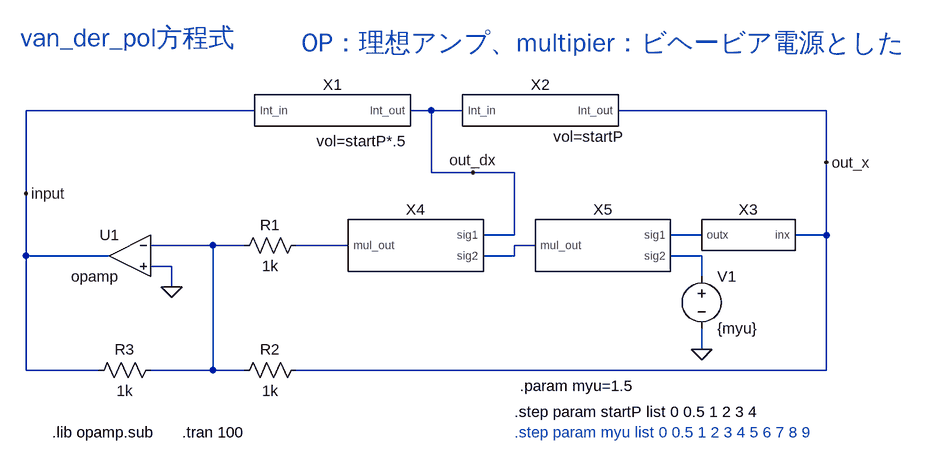
[diagram p0: schematic van_der_pol-lv1.asc]
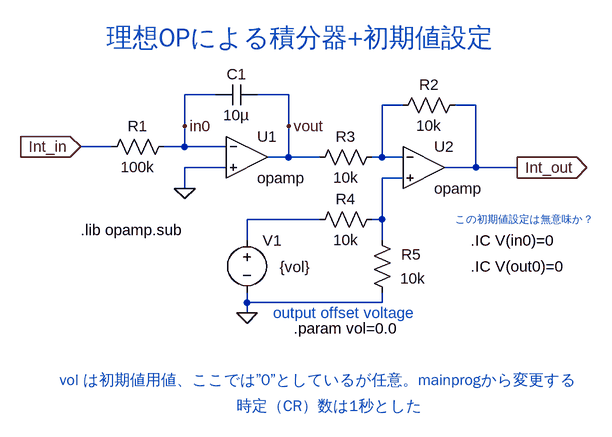
[diagram p1: sub-circuit int_lv2.asc]
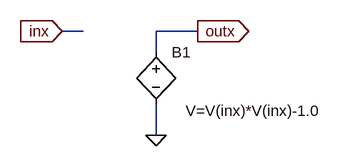
[diagram p2: sub-circuit x2-1_lv1.asc]
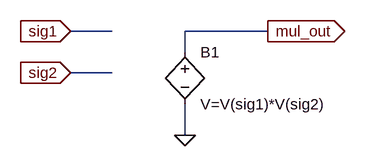
[diagram p3: sub-circuit mul_lv1.asc]
van_der_pol-lv1.asc, the LTspice schematic file:
Version 4.1
SHEET 1 880 680
WIRE -320 -80 -672 -80
WIRE -48 -80 -80 -80
WIRE 0 -80 -48 -80
WIRE 560 -80 240 -80
WIRE 560 0 560 -80
WIRE -48 16 -48 -80
WIRE 16 16 -48 16
WIRE 80 16 16 16
WIRE -672 48 -672 -80
WIRE 80 112 80 16
WIRE 80 112 32 112
WIRE 368 112 320 112
WIRE 560 112 560 0
WIRE 560 112 512 112
WIRE -384 128 -480 128
WIRE -336 128 -384 128
WIRE -176 128 -256 128
WIRE 112 128 80 128
WIRE -672 144 -672 48
WIRE -544 144 -672 144
WIRE 80 144 80 128
WIRE 80 144 32 144
WIRE 368 144 320 144
WIRE -448 160 -480 160
WIRE 368 176 368 144
WIRE -448 192 -448 160
WIRE 368 288 368 256
WIRE -672 320 -672 144
WIRE -560 320 -672 320
WIRE -384 320 -384 128
WIRE -384 320 -480 320
WIRE -336 320 -384 320
WIRE 560 320 560 112
WIRE 560 320 -256 320
FLAG -448 192 0
FLAG 368 288 0
FLAG 560 0 out_x
FLAG 16 16 out_dx
FLAG -672 48 input
SYMBOL OpAmps\\opamp -512 80 M0
SYMATTR InstName U1
SYMATTR SpiceLine Aol=10Meg
SYMATTR SpiceLine2 GBW=1G
SYMBOL res -240 112 R90
WINDOW 0 0 56 VBottom 2
WINDOW 3 32 56 VTop 2
SYMATTR InstName R1
SYMATTR Value 1k
SYMBOL res -240 304 R90
WINDOW 0 0 56 VBottom 2
WINDOW 3 32 56 VTop 2
SYMATTR InstName R2
SYMATTR Value 1k
SYMBOL res -464 304 R90
WINDOW 0 0 56 VBottom 2
WINDOW 3 32 56 VTop 2
SYMATTR InstName R3
SYMATTR Value 1k
SYMBOL voltage 368 160 R0
WINDOW 123 0 0 Left 0
WINDOW 39 0 0 Left 0
SYMATTR InstName V1
SYMATTR Value {myu}
SYMBOL INT_lv2 -208 -80 R0
WINDOW 39 52 63 Bottom 2
WINDOW 1 -80 32 Left 1
SYMATTR SpiceLine vol=startP*.5
SYMATTR InstName X1
SYMBOL INT_lv2 112 -80 R0
WINDOW 39 82 56 Bottom 2
WINDOW 1 -80 32 Left 1
SYMATTR SpiceLine vol=startP
SYMATTR InstName X2
SYMBOL x2-1_lv1 448 112 M0
SYMATTR InstName X3
SYMBOL mul_lv1 -64 128 M0
SYMATTR InstName X4
SYMBOL mul_lv1 224 128 M0
SYMATTR InstName X5
TEXT -632 416 Left 2 !.lib opamp.sub
TEXT -432 416 Left 2 !.tran 100
TEXT 88 344 Left 2 !.param myu=1.5
TEXT 80 416 Left 2 ;.step param myu list 0 0.5 1 2 3 4 5 6 7 8 9
TEXT -248 -184 Left 4 ;OP：理想アンプ、multipier：ビヘービア電源とした
TEXT -680 -192 Left 4 ;van_der_pol方程式
TEXT 80 384 Left 2 !.step param startP list 0 0.5 1 2 3 4

int_lv2.asc, the sub-circuit schematic file:
Version 4.1
SHEET 1 880 680
WIRE 16 -128 -32 -128
WIRE 128 -128 80 -128
WIRE 304 -112 272 -112
WIRE 416 -112 384 -112
WIRE -32 -80 -32 -128
WIRE 128 -80 128 -128
WIRE -144 -48 -192 -48
WIRE -32 -48 -32 -80
WIRE -32 -48 -64 -48
WIRE 32 -48 -32 -48
WIRE 128 -32 128 -80
WIRE 128 -32 96 -32
WIRE 176 -32 128 -32
WIRE 272 -32 272 -112
WIRE 272 -32 256 -32
WIRE 304 -32 272 -32
WIRE 32 -16 -32 -16
WIRE 416 -16 416 -112
WIRE 416 -16 368 -16
WIRE 480 -16 416 -16
WIRE 304 0 272 0
WIRE -32 16 -32 -16
WIRE 176 64 64 64
WIRE 272 64 272 0
WIRE 272 64 256 64
WIRE 64 96 64 64
WIRE 272 96 272 64
WIRE 64 192 64 176
WIRE 272 192 272 176
WIRE 272 192 64 192
WIRE 64 208 64 192
FLAG -192 -48 Int_in
IOPIN -192 -48 In
FLAG 128 -80 vout
FLAG 480 -16 Int_out
IOPIN 480 -16 Out
FLAG -32 -80 in0
FLAG -32 16 0
FLAG 64 208 0
SYMBOL cap 16 -112 R270
WINDOW 0 32 32 VTop 2
WINDOW 3 0 32 VBottom 2
SYMATTR InstName C1
SYMATTR Value 10µ
SYMBOL res -48 -64 R90
WINDOW 0 0 56 VBottom 2
WINDOW 3 32 56 VTop 2
SYMATTR InstName R1
SYMATTR Value 100k
SYMBOL OpAmps\\opamp 64 -96 R0
SYMATTR InstName U1
SYMATTR SpiceLine Aol=10meg
SYMATTR SpiceLine2 GBW=1g
SYMBOL OpAmps\\opamp 336 -80 R0
SYMATTR InstName U2
SYMATTR SpiceLine Aol=10meg
SYMATTR SpiceLine2 GBW=1g
SYMBOL res 400 -128 R90
WINDOW 0 0 56 VBottom 2
WINDOW 3 32 56 VTop 2
SYMATTR InstName R2
SYMATTR Value 10k
SYMBOL res 272 -48 R90
WINDOW 0 0 56 VBottom 2
WINDOW 3 32 56 VTop 2
SYMATTR InstName R3
SYMATTR Value 10k
SYMBOL res 272 48 R90
WINDOW 0 0 56 VBottom 2
WINDOW 3 32 56 VTop 2
SYMATTR InstName R4
SYMATTR Value 10k
SYMBOL res 288 192 R180
WINDOW 0 -44 74 Left 2
WINDOW 3 -51 37 Left 2
SYMATTR InstName R5
SYMATTR Value 10k
SYMBOL voltage 64 80 R0
WINDOW 123 0 0 Left 0
WINDOW 39 0 0 Left 0
WINDOW 3 50 57 Left 2
SYMATTR Value {vol}
SYMATTR InstName V1
TEXT -192 80 Left 2 !.lib opamp.sub
TEXT 136 232 Left 2 !.param vol=0.0
TEXT -224 312 Left 2 ;vol は初期値用値、ここでは”0”としているが任意。mainprogから変更する
TEXT 48 352 Left 2 ;時定（CR）数は1秒とした
TEXT 104 208 Left 2 ;output offset voltage
TEXT 408 96 Left 2 !.IC V(in0)=0
TEXT 408 136 Left 2 !.IC V(out0)=0
TEXT 384 64 Left 1 ;この初期値設定は無意味か？
TEXT -152 -216 Left 4 ;理想OPによる積分器+初期値設定

x2-1_lv1.asc, the sub-circuit schematic file:
Version 4.1
SHEET 1 880 680
WIRE 64 96 32 96
WIRE 240 96 176 96
WIRE 176 128 176 96
WIRE 176 256 176 208
FLAG 176 256 0
FLAG 240 96 outx
IOPIN 240 96 Out
FLAG 32 96 inx
IOPIN 32 96 In
SYMBOL bv 176 112 R0
WINDOW 3 46 106 Left 2
SYMATTR Value V=V(inx)*V(inx)-1.0
SYMATTR InstName B1

mul_lv1.asc, the sub-circuit schematic file:
Version 4.1
SHEET 1 880 680
WIRE 0 64 -64 64
WIRE 240 64 112 64
WIRE 112 96 112 64
WIRE 0 128 -64 128
WIRE 112 224 112 176
FLAG 112 224 0
FLAG -64 64 sig1
IOPIN -64 64 In
FLAG 240 64 mul_out
IOPIN 240 64 Out
FLAG -64 128 sig2
IOPIN -64 128 In
SYMBOL bv 112 80 R0
SYMATTR InstName B1
SYMATTR Value V=V(sig1)*V(sig2)

The netlist it stands for:
* van_der_pol-lv1.asc
X§U1 N002 0 input opamp Aol=10Meg GBW=1G  ; pins invin noninvin out
R1 N003 N002 1k
R2 out_x N002 1k
R3 N002 input 1k
V1 N005 0 {myu}
X§X1 input out_dx int_lv2 params: vol=startP*.5
X§X2 out_dx out_x int_lv2 params: vol=startP
X§X3 out_x N001 x2-1_lv1
X§X4 out_dx N004 N003 mul_lv1
X§X5 N001 N005 N004 mul_lv1

* block symbol definitions
.subckt int_lv2 Int_in Int_out
C1 in0 vout 10µ
R1 in0 Int_in 100k
X§U1 in0 0 vout opamp Aol=10meg GBW=1g  ; pins invin noninvin out
X§U2 N001 N002 Int_out opamp Aol=10meg GBW=1g  ; pins invin noninvin out
R2 Int_out N001 10k
R3 N001 vout 10k
R4 N002 N003 10k
R5 0 N002 10k
V1 N003 0 {vol}
.lib opamp.sub
.param vol=0.0
* vol は初期値用値、ここでは”0”としているが任意。mainprogから変更する
* 時定（CR）数は1秒とした
* output offset voltage
.IC V(in0)=0
.IC V(out0)=0
* この初期値設定は無意味か？
* 理想OPによる積分器+初期値設定
.ends int_lv2

.subckt x2-1_lv1 inx outx
B1 outx 0 V=V(inx)*V(inx)-1.0
.ends x2-1_lv1

.subckt mul_lv1 sig1 sig2 mul_out
B1 mul_out 0 V=V(sig1)*V(sig2)
.ends mul_lv1

.lib opamp.sub
.tran 100
.param myu=1.5
* .step param myu list 0 0.5 1 2 3 4 5 6 7 8 9
* OP：理想アンプ、multipier：ビヘービア電源とした
* van_der_pol方程式
.step param startP list 0 0.5 1 2 3 4
.backanno
.end